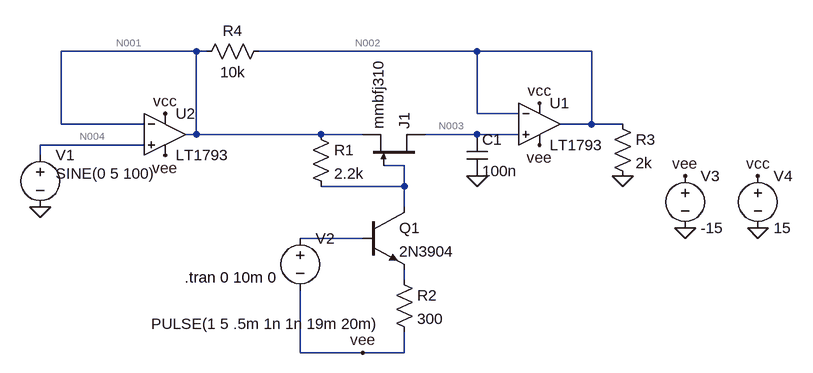
[diagram p0: schematic sample-hold.asc]
sample-hold.asc, the LTspice schematic file:
Version 4
SHEET 1 880 680
WIRE -64 0 -272 0
WIRE -48 0 -64 0
WIRE 368 0 32 0
WIRE 544 0 368 0
WIRE 368 96 368 0
WIRE 432 96 368 96
WIRE -272 112 -272 0
WIRE -144 112 -272 112
WIRE 544 112 544 0
WIRE 544 112 496 112
WIRE 592 112 544 112
WIRE -64 128 -64 0
WIRE -64 128 -80 128
WIRE 128 128 -64 128
WIRE 192 128 128 128
WIRE 368 128 288 128
WIRE 432 128 368 128
WIRE -144 144 -304 144
WIRE -304 160 -304 144
WIRE 256 176 224 176
WIRE 256 208 256 176
WIRE 256 208 128 208
WIRE 256 240 256 208
WIRE 192 288 96 288
WIRE 256 352 256 336
WIRE 96 464 96 368
WIRE 192 464 96 464
WIRE 256 464 256 432
WIRE 256 464 192 464
FLAG -304 240 0
FLAG 368 192 0
FLAG 192 464 vee
FLAG 688 272 0
FLAG 688 192 vee
FLAG 592 192 0
FLAG 464 144 vee
FLAG -112 160 vee
FLAG 800 272 0
FLAG 800 192 vcc
FLAG 464 80 vcc
FLAG -112 96 vcc
SYMBOL njf 288 176 M270
SYMATTR InstName J1
SYMATTR Value mmbfj310
SYMBOL voltage -304 144 R0
WINDOW 3 24 44 Left 0
WINDOW 123 0 0 Left 0
WINDOW 39 0 0 Left 0
SYMATTR InstName V1
SYMATTR Value SINE(0 5 100)
SYMBOL cap 352 128 R0
SYMATTR InstName C1
SYMATTR Value 100n
SYMBOL res 112 112 R0
SYMATTR InstName R1
SYMATTR Value 2.2k
SYMBOL npn 192 240 R0
SYMATTR InstName Q1
SYMATTR Value 2N3904
SYMBOL voltage 96 272 R0
WINDOW 3 -229 148 Left 0
WINDOW 123 0 0 Left 0
WINDOW 39 0 0 Left 0
SYMATTR InstName V2
SYMATTR Value PULSE(1 5 .5m 1n 1n 19m 20m)
SYMBOL res 240 336 R0
SYMATTR InstName R2
SYMATTR Value 300
SYMBOL voltage 688 176 R0
WINDOW 123 0 0 Left 0
WINDOW 39 0 0 Left 0
SYMATTR InstName V3
SYMATTR Value -15
SYMBOL Opamps\\LT1793 464 48 R0
SYMATTR InstName U1
SYMBOL Opamps\\LT1793 -112 64 R0
SYMATTR InstName U2
SYMBOL res 576 96 R0
SYMATTR InstName R3
SYMATTR Value 2k
SYMBOL voltage 800 176 R0
WINDOW 123 0 0 Left 0
WINDOW 39 0 0 Left 0
SYMATTR InstName V4
SYMATTR Value 15
SYMBOL res 48 -16 R90
WINDOW 0 0 56 VBottom 0
WINDOW 3 32 56 VTop 0
SYMATTR InstName R4
SYMATTR Value 10k
TEXT -82 348 Left 0 !.tran 0 10m 0

The netlist it stands for:
* sample-hold.asc
J1 N003 N005 N001 mmbfj310
V1 N004 0 SINE(0 5 100)
C1 N003 0 100n
R1 N001 N005 2.2k
Q1 N005 N006 N007 0 2N3904
V2 N006 vee PULSE(1 5 .5m 1n 1n 19m 20m)
R2 N007 vee 300
V3 vee 0 -15
XU1 N003 N002 vcc vee N002 LT1793  ; pins In+ In- V+ V- OUT
XU2 N004 N001 vcc vee N001 LT1793  ; pins In+ In- V+ V- OUT
R3 N002 0 2k
V4 vcc 0 15
R4 N002 N001 10k
.model NPN NPN
.model PNP PNP
.lib standard.bjt
.model NJF NJF
.model PJF PJF
.lib standard.jft
.tran 0 10m 0
.lib LTC.lib
.backanno
.end

* Results of the author's LTspice run, read from the files saved beside the schematic
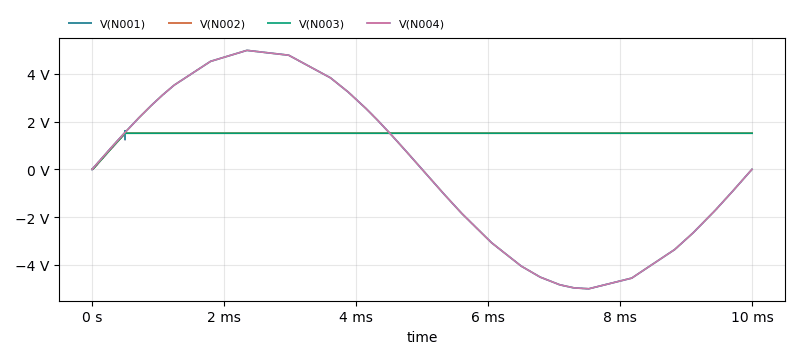
[diagram p1: Transient Analysis of sample-hold.asc, plotted from the saved traces]
* Transient Analysis, 1 run:
*   V(N001): min -5 V, max 4.977 V, average -1.748 mV, rms 3.517 V, last -261.6 µV
*   V(N002): min 500 µV, max 1.511 V, average 1.472 V, rms 1.486 V, last 1.51 V
*   V(N003): min 250 µV, max 1.51 V, average 1.472 V, rms 1.485 V, last 1.51 V
*   V(N004): min -5 V, max 4.977 V, average -1.996 mV, rms 3.517 V, last 0 V